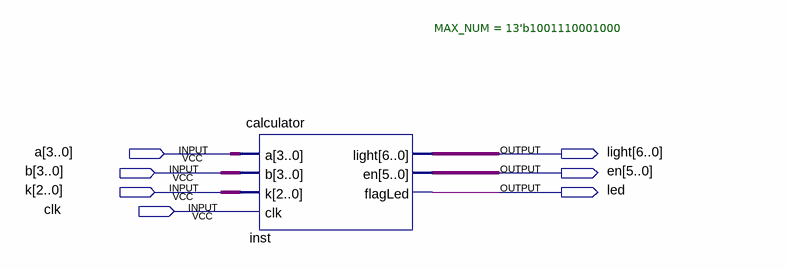
[diagram p0: schematic sheet]
// Quartus schematic Block1.bdf as structural Verilog: 1 symbols, 7 pins
module Block1 (
  input  [3:0] a,
  input  [3:0] b,
  input  [2:0] k,
  input  clk,
  output [6:0] light,
  output [5:0] en,
  output led
);

  calculator #(.MAX_NUM(13'b1001110001000)) inst (
    .a(a), .b(b), .k(k), .clk(clk), .light(light), .en(en), .flagLed(led));
endmodule
